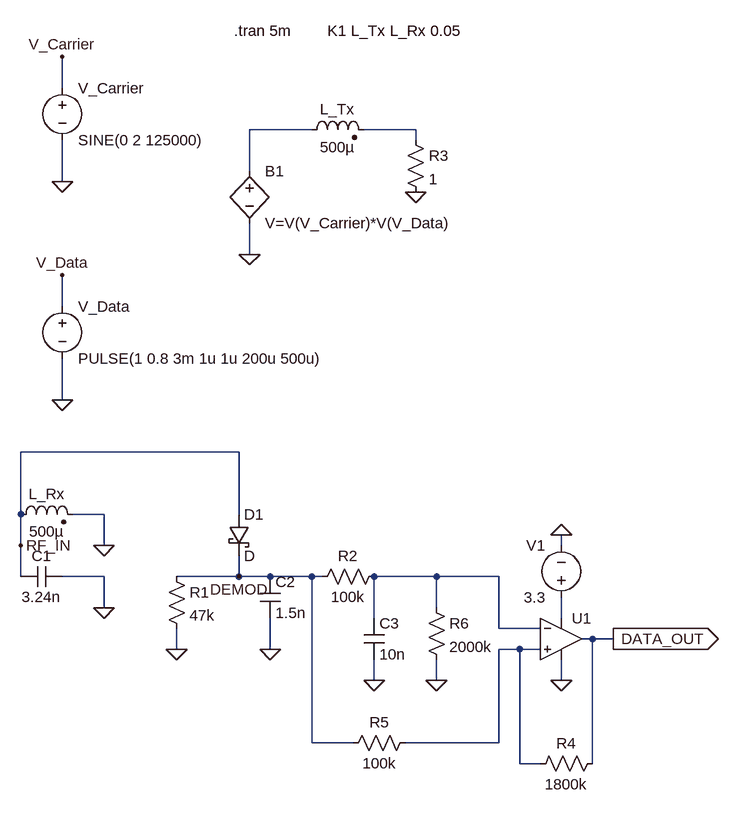
[diagram p0: schematic longRangeFOBSimulator.asc]
longRangeFOBSimulator.asc, the LTspice schematic file:
Version 4
SHEET 1 2264 1256
WIRE 304 176 304 128
WIRE 688 240 592 240
WIRE 848 240 768 240
WIRE 848 256 848 240
WIRE 592 304 592 240
WIRE 304 320 304 256
WIRE 592 432 592 384
WIRE 304 512 304 464
WIRE 304 656 304 592
WIRE 576 736 240 736
WIRE 240 832 240 736
WIRE 368 832 320 832
WIRE 576 832 576 736
WIRE 240 880 240 832
WIRE 368 880 368 832
WIRE 1072 880 1072 864
WIRE 240 928 240 880
WIRE 368 928 304 928
WIRE 576 928 576 896
WIRE 576 928 480 928
WIRE 624 928 576 928
WIRE 688 928 624 928
WIRE 704 928 688 928
WIRE 880 928 784 928
WIRE 976 928 880 928
WIRE 368 976 368 928
WIRE 880 976 880 928
WIRE 784 992 784 928
WIRE 1072 992 1072 960
WIRE 976 1008 976 928
WIRE 1040 1008 976 1008
WIRE 1120 1024 1104 1024
WIRE 1152 1024 1120 1024
WIRE 480 1040 480 1008
WIRE 624 1040 624 992
WIRE 1008 1040 976 1040
WIRE 1040 1040 1008 1040
WIRE 784 1088 784 1056
WIRE 880 1088 880 1056
WIRE 1072 1088 1072 1056
WIRE 688 1184 688 928
WIRE 752 1184 688 1184
WIRE 976 1184 976 1040
WIRE 976 1184 832 1184
WIRE 1008 1216 1008 1040
WIRE 1040 1216 1008 1216
WIRE 1120 1216 1120 1024
FLAG 304 320 0
FLAG 304 656 0
FLAG 592 432 0
FLAG 368 880 0
FLAG 368 976 0
FLAG 240 880 RF_IN
FLAG 480 1040 0
FLAG 624 1040 0
FLAG 576 928 DEMOD
FLAG 784 1088 0
FLAG 1072 1088 0
FLAG 1072 864 0
FLAG 1152 1024 DATA_OUT
IOPIN 1152 1024 Out
FLAG 304 128 V_Carrier
FLAG 304 464 V_Data
FLAG 848 336 0
FLAG 880 1088 0
SYMBOL voltage 304 160 R0
SYMATTR InstName V_Carrier
SYMATTR Value SINE(0 2 125000)
SYMBOL Voltage 304 496 R0
SYMATTR InstName V_Data
SYMATTR Value PULSE(1 0.8 3m 1u 1u 200u 500u)
SYMBOL bv 592 288 R0
SYMATTR InstName B1
SYMATTR Value V=V(V_Carrier)*V(V_Data)
SYMBOL ind2 672 256 R270
WINDOW 0 32 56 VTop 2
WINDOW 3 5 56 VBottom 2
SYMATTR InstName L_Tx
SYMATTR Value 500µ
SYMATTR Type ind
SYMBOL ind2 224 848 R270
WINDOW 0 32 56 VTop 2
WINDOW 3 5 56 VBottom 2
SYMATTR InstName L_Rx
SYMATTR Value 500µ
SYMATTR Type ind
SYMBOL Cap 304 912 R90
WINDOW 0 0 32 VBottom 2
WINDOW 3 32 32 VTop 2
SYMATTR InstName C1
SYMATTR Value 3.24n
SYMBOL schottky 560 832 R0
SYMATTR InstName D1
SYMBOL Res 464 912 R0
SYMATTR InstName R1
SYMATTR Value 47k
SYMBOL Cap 608 928 R0
SYMATTR InstName C2
SYMATTR Value 1.5n
SYMBOL Res 688 944 R270
WINDOW 0 32 56 VTop 2
WINDOW 3 0 56 VBottom 2
SYMATTR InstName R2
SYMATTR Value 100k
SYMBOL Cap 768 992 R0
SYMATTR InstName C3
SYMATTR Value 10n
SYMBOL UniversalOpAmp2 1072 1024 R0
SYMATTR InstName U1
SYMBOL Voltage 1072 976 R180
WINDOW 0 24 96 Left 2
WINDOW 3 24 16 Left 2
SYMATTR InstName V1
SYMATTR Value 3.3
SYMBOL Res 832 240 R0
SYMATTR InstName R3
SYMATTR Value 1
SYMBOL Res 1136 1200 R90
WINDOW 0 0 56 VBottom 2
WINDOW 3 32 56 VTop 2
SYMATTR InstName R4
SYMATTR Value 1800k
SYMBOL Res 848 1168 R90
WINDOW 0 0 56 VBottom 2
WINDOW 3 32 56 VTop 2
SYMATTR InstName R5
SYMATTR Value 100k
SYMBOL Res 864 960 R0
SYMATTR InstName R6
SYMATTR Value 2000k
TEXT 712 88 Left 2 !K1 L_Tx L_Rx 0.05
TEXT 568 88 Left 2 !.tran 5m

The netlist it stands for:
* longRangeFOBSimulator.asc
V_Carrier V_Carrier 0 SINE(0 2 125000)
V_Data V_Data 0 PULSE(1 0.8 3m 1u 1u 200u 500u)
B1 N001 0 V=V(V_Carrier)*V(V_Data)
L_Tx N001 N002 500µ
L_Rx RF_IN 0 500µ
C1 0 RF_IN 3.24n
D1 RF_IN DEMOD D
R1 DEMOD 0 47k
C2 DEMOD 0 1.5n
R2 DEMOD N003 100k
C3 N003 0 10n
XU1 N005 N003 N004 0 DATA_OUT level2 Avol=1Meg GBW=10Meg Slew=10Meg Ilimit=25m Rail=0 Vos=0 En=0 Enk=0 In=0 Ink=0 Rin=500Meg  ; pins In+ In- V+ V- OUT
V1 N004 0 3.3
R3 N002 0 1
R4 DATA_OUT N005 1800k
R5 N005 DEMOD 100k
R6 N003 0 2000k
.model D D
.lib standard.dio
K1 L_Tx L_Rx 0.05
.tran 5m
.lib UniversalOpAmp2.lib
.backanno
.end